# Altium project link_t.PrjPcb
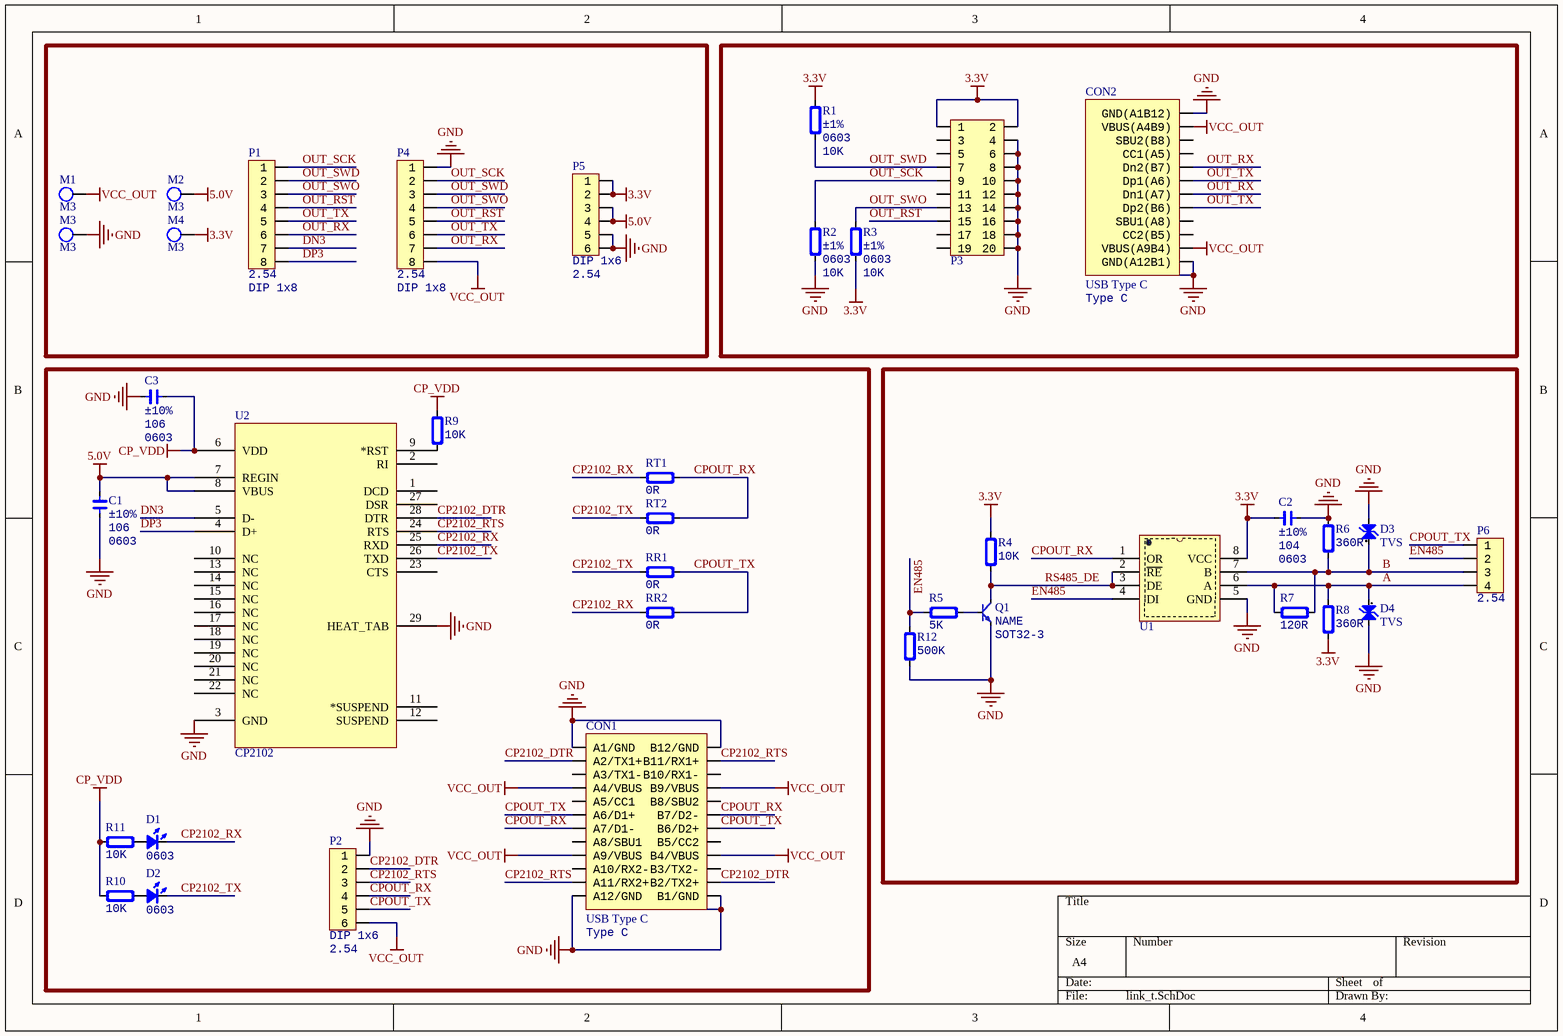
[diagram p0: link_t.SchDoc]
1 sheet, 38 parts. Net scope: global (net labels, ports and power ports of the same name join across sheets).
Board file: link_t.PcbDoc

## Sheet link_t.SchDoc
size A4

### Parts
C1  value 106  Note: ±10%  Type: 0603  [CAP_0603]  (hidden comment: C0603)
C2  value 104  Note: ±10%  Type: 0603  [CAP_0603]  (hidden comment: C0603)
C3  value 106  Note: ±10%  Type: 0603  [CAP_0603]  (hidden comment: C0603)
CON1  USB Type C  value Type C  [USB_TypeC_SMD_24P]
CON2  USB Type C  value Type C  [USB_TypeC_SMD_16P]
D1  Type: 0603  [LED_0603_RED]  (hidden comment: D0603)
D2  Type: 0603  [LED_0603_RED]  (hidden comment: D0603)
D3  TVS  [LED_0603_YELLOW]
D4  TVS  [LED_0603_YELLOW]
M1  M3  [M3]
M2  M3  [M3]
M3  M3  [M3]
M4  M3  [M3]
P1  value 2.54  Type: DIP 1x8  [HDR1x8_TOP]  (hidden comment: HDR1x8)
P2  value 2.54  Type: DIP 1x6  [HDR1x6_TOP]  (hidden comment: HDR1x6)
P3  HDR2x10  [JN_STM_20PIN]  (value not drawn)
P4  value 2.54  Type: DIP 1x8  [HDR1X8_H]  (hidden comment: HDR1x8)
P5  value 2.54  Type: DIP 1x6  [HDR1x6_TOP]  (hidden comment: HDR1x6)
P6  value 2.54  [HDR1x4_TOP]  (hidden comment: HDR1x4)
Q1  Type: SOT32-3  [SOT23-3]  (hidden comment: NAME)
R1  value 10K  Note: ±1%  Type: 0603  [RES_0603]  (hidden comment: R0603)
R2  value 10K  Note: ±1%  Type: 0603  [RES_0603]  (hidden comment: R0603)
R3  value 10K  Note: ±1%  Type: 0603  [RES_0603]  (hidden comment: R0603)
R4  value 10K  [RES_0603]  (hidden comment: R0603)
R5  value 5K  [RES_0603]  (hidden comment: R0603)
R6  value 360R  [RES_0603]  (hidden comment: R0603)
R7  value 120R  [RES_0603]  (hidden comment: R0603)
R8  value 360R  [RES_0603]  (hidden comment: R0603)
R9  value 10K  [RES_0603]  (hidden comment: R0603)
R10  value 10K  [RES_0603]  (hidden comment: R0603)
R11  value 10K  [RES_0603]  (hidden comment: R0603)
R12  value 500K  [RES_0603]  (hidden comment: R0603)
RR1  value 0R  [RES_0603]  (hidden comment: R0603)
RR2  value 0R  [RES_0603]  (hidden comment: R0603)
RT1  value 0R  [RES_0603]  (hidden comment: R0603)
RT2  value 0R  [RES_0603]  (hidden comment: R0603)
U1  SP3485  [SOP8]  (value not drawn)
U2  CP2102  [QFN-28]

### Nets
3.3V: C2.2 M4.1 P3.1 P3.2 P5.1 P5.2 R1.1 R3.1 R4.1 R8.1 U1.8(VCC)
5.0V: C1.2 M2.1 P5.3 P5.4 U2.7(REGIN) U2.8(VBUS)
CP_VDD: C3.2 R9.2 R10.1 R11.1 U2.6(VDD)
GND: C1.1 C2.1 C3.1 CON1.0(SH) CON1.A1(A1/GND) CON1.A12(A12/GND) CON1.B1(B1/GND) CON1.B12(B12/GND) CON2.0(SH) CON2.A1B12(GND(A1B12)) CON2.A12B1(GND(A12B1)) D3.2(K) D4.2(K) M3.1 P2.1 P3.4 P3.6 P3.8 P3.10 P3.12 P3.14 P3.16 P3.18 P3.20 P4.1 P5.5 P5.6 Q1.2(E) R2.1 R6.2 R12.2 U1.5(GND) U2.3(GND) U2.29(HEAT_TAB)
VCC_OUT: CON1.A4(A4/VBUS) CON1.A9(A9/VBUS) CON1.B4(B4/VBUS) CON1.B9(B9/VBUS) CON2.A4B9(VBUS(A4B9)) CON2.A9B4(VBUS(A9B4)) M1.1 P2.6 P4.8
A: D4.1(A) P6.4 R7.1 R8.2 U1.6(A)
B: D3.1(A) P6.3 R6.1 R7.2 U1.7(B)
CP2102_DTR: CON1.A2(A2/TX1+) CON1.B2(B2/TX2+) P2.2 U2.28(DTR)
CP2102_RTS: CON1.A11(A11/RX2+) CON1.B11(B11/RX1+) P2.3 U2.24(RTS)
CP2102_RX: D1.2(K) RR2.2 RT1.2 U2.25(RXD)
CP2102_TX: D2.2(K) RR1.2 RT2.2 U2.26(TXD)
CPOUT_RX: CON1.A7(A7/D1-) CON1.B7(B7/D2-) P2.4 RT1.1 RT2.1 U1.1(OR)
CPOUT_TX: CON1.A6(A6/D1+) CON1.B6(B6/D2+) P2.5 P6.1 RR1.1 RR2.1
DN3: P1.7 U2.5(D-)
DP3: P1.8 U2.4(D+)
EN485: P6.2 R5.2 R12.1 U1.4(DI)
OUT_RST: P1.4 P3.15 P4.5
OUT_RX: CON2.A7(Dn1(A7)) CON2.B7(Dn2(B7)) P1.6 P4.7
OUT_SCK: P1.1 P3.9 P4.2 R2.2
OUT_SWD: P1.2 P3.7 P4.3 R1.2
OUT_SWO: P1.3 P3.13 P4.4 R3.2
OUT_TX: CON2.A6(Dp1(A6)) CON2.B6(Dp2(B6)) P1.5 P4.6
RS485_DE: Q1.3(C) R4.2 U1.2(~{RE}) U1.3(DE)
NetD1_1: D1.1(A) R11.2
NetD2_1: D2.1(A) R10.2
NetQ1_1: Q1.1(B) R5.1
NetR9_1: R9.1 U2.9(*RST)

Not connected (* = marked no-connect by the designer): CON1 A3(A3/TX1-) A5(A5/CC1) A8(A8/SBU1) A10(A10/RX2-) B3(B3/TX2-) B5(B5/CC2) B8(B8/SBU2) B10(B10/RX1-); CON2 A5(CC1(A5)) A8(SBU1(A8)) B5(CC2(B5)) B8(SBU2(B8)); P3 3 5 11 17 19; U2 1(DCD) 2(RI) 10(NC) 11(*SUSPEND) 12(SUSPEND) 13(NC) 14(NC) 15(NC) 16(NC) 17(NC) 18(NC) 19(NC) 20(NC) 21(NC) 22(NC) 23(CTS) 27(DSR)

### Library data of the parts
C1-C3 = Cap_0603: Capacitor; Specification: X7R, ±10%, 16V; Manufacturer: *
CON1 = USB_TypeC: USB; Type: *
CON2 = USB_TypeC_16P: USB; Type: *
D1 D2 = LED_0603: LED; Value: color?; Manufacturer: *; Specification: *; Note: *
D3 D4 = ESD LESD5D5.0CT1G: 静电保护二极管,VRWM=5V.IPP=9.4A
M1-M4 = M3: M3 Nut
P1 P4 = HDR1x8_2.54TOP: Header Top
P2 P5 = HDR1x6_2.54TOP: Header Top
P3 = HDR2x10_2.54: Header
P6 = HDR1x4_2.54TOP: Header Top; Type: DIP 1x4
Q1 = BJT_NPN: Transistor; Note: NPN; Manufacturer: *; Specification: *; Value: NAME
R1-R3 = Res_0603: Resistor; Manufacturer: *; Specification: ±1%
R4-R12 RR1 RR2 RT1 RT2 = Res_0603: Resistor; Specification: ±1%; Manufacturer: *; Note: ±1%; Type: 0603
U1 = SP3485: 半双工收发器
U2 = CP2102: USB转TTL; PART DESC: SINGLE-CHIP USB TO UART BRIDGE, QFN28, RoHS.; MFG #1: SILICON LABS; PART NUMBER: CP2102; Value: Value; RefDes: RefDes; Type: DEV